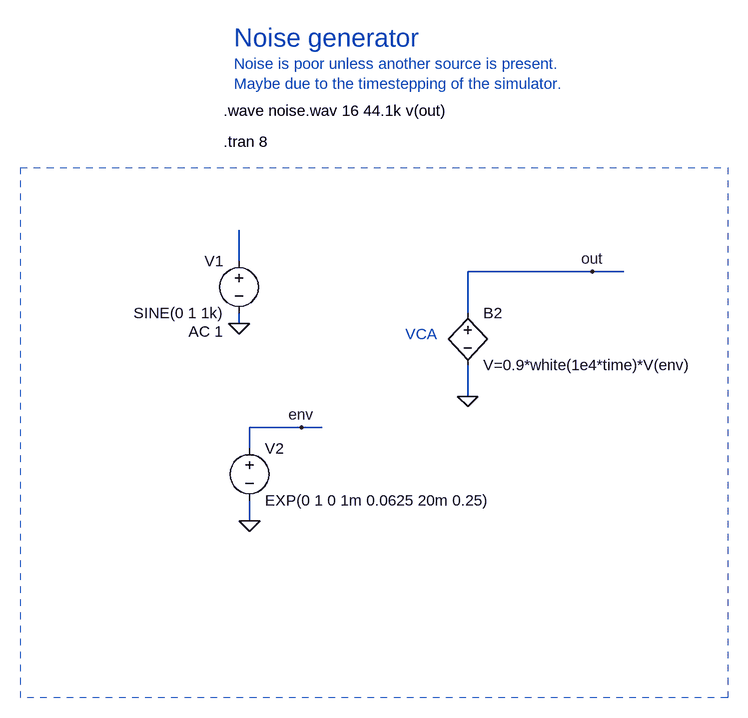
[diagram p0: schematic noise.asc]
noise.asc, the LTspice schematic file:
Version 4
SHEET 1 1536 820
WIRE -1568 0 -1568 -48
WIRE -1024 16 -1216 16
WIRE -976 16 -1024 16
WIRE -1216 80 -1216 16
WIRE -1568 96 -1568 80
WIRE -1216 208 -1216 160
WIRE -1472 256 -1552 256
WIRE -1440 256 -1472 256
WIRE -1552 288 -1552 256
WIRE -1552 400 -1552 368
FLAG -1568 96 0
FLAG -1216 208 0
FLAG -1024 16 out
FLAG -1552 400 0
FLAG -1472 256 env
SYMBOL voltage -1568 -16 M0
WINDOW 123 24 124 Left 2
WINDOW 39 0 0 Left 2
SYMATTR Value2 AC 1
SYMATTR InstName V1
SYMATTR Value SINE(0 1 1k)
SYMBOL bv -1216 64 R0
SYMATTR InstName B2
SYMATTR Value V=0.9*white(1e4*time)*V(env)
SYMBOL voltage -1552 272 R0
WINDOW 123 0 0 Left 0
WINDOW 39 0 0 Left 0
SYMATTR InstName V2
SYMATTR Value EXP(0 1 0 1m 0.0625 20m 0.25)
TEXT -1592 -184 Left 2 !.tran 8
TEXT -1576 -344 Left 4 ;Noise generator
TEXT -1592 -232 Left 2 !.wave noise.wav 16 44.1k v(out)
TEXT -1576 -304 Left 2 ;Noise is poor unless another source is present.\nMaybe due to the timestepping of the simulator.
TEXT -1312 112 Left 2 ;VCA
RECTANGLE Normal -816 672 -1904 -144 2

The netlist it stands for:
* noise.asc
V1 N001 0 SINE(0 1 1k) AC 1
B2 out 0 V=0.9*white(1e4*time)*V(env)
V2 env 0 EXP(0 1 0 1m 0.0625 20m 0.25)
.tran 8
* Noise generator
.wave noise.wav 16 44.1k v(out)
* Noise is poor unless another source is present.
* Maybe due to the timestepping of the simulator.
* VCA
.backanno
.end